# Altium schematic sheet Strain.SchDoc
size 297 x 209 mm; SheetNumber: 4; SheetTotal: 4; SheetTitle: Strain Gauge Frontend
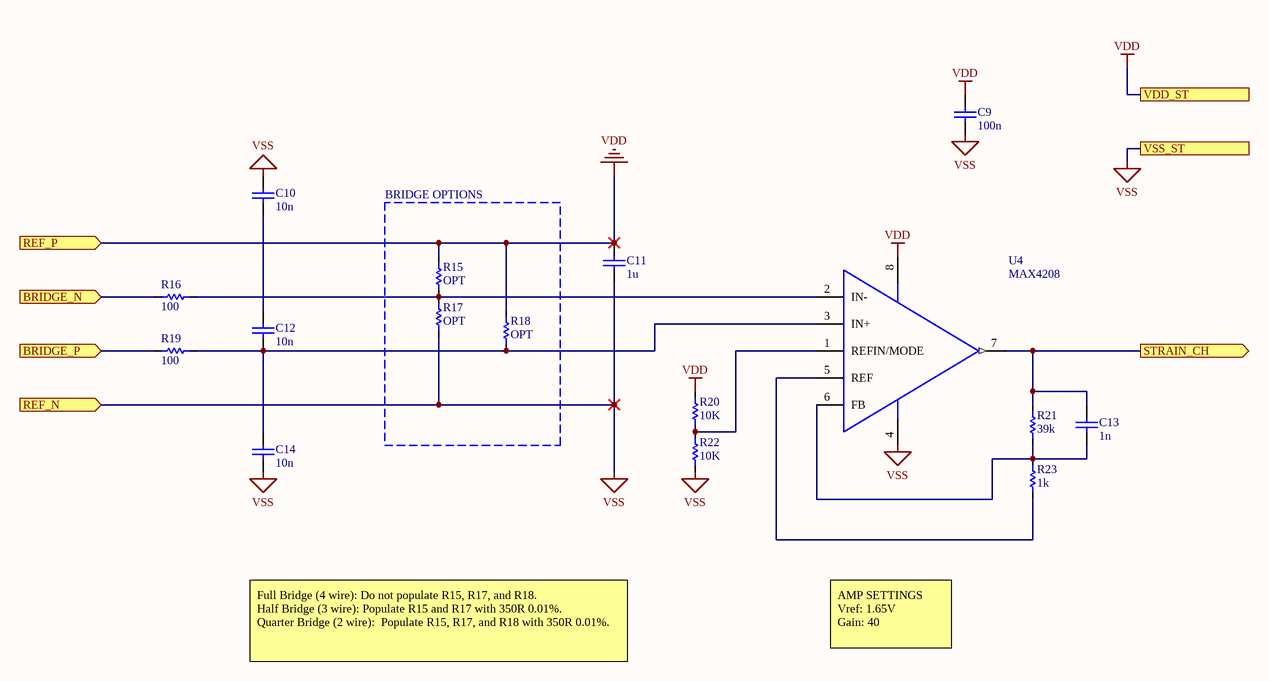
[diagram p0: Strain.SchDoc]

## Parts
C9  100n  [CAP_0603_M]
C10  10n  [CAP_0603_M]
C11  1u  [CAP_0603_M]
C12  10n  [CAP_0603_M]
C13  1n  [CAP_0603_M]
C14  10n  [CAP_0603_M]
R15  OPT  [RES_0603_M]
R16  100  [RES_0603_M]
R17  OPT  [RES_0603_M]
R18  OPT  [RES_0603_M]
R19  100  [RES_0603_M]
R20  10K  [RES_0603_M]
R21  39k  [RES_0603_M]
R22  10K  [RES_0603_M]
R23  1k  [RES_0603_M]
U4  MAX4208  [MAX4208_SOP127P600-8N]

## Blocks framed on the sheet
BRIDGE OPTIONS: R15 R17 R18

## Ports
BRIDGE_N (in), BRIDGE_P (in), REF_N (in), REF_P (in), STRAIN_CH (out), VDD_ST, VSS_ST

## Nets
VDD: C9.2 C11.2 R15.2 R18.2 R20.2 U4.8(V+) ; port REF_P, port VDD_ST
VSS: C9.1 C10.2 C11.1 C14.1 R17.1 R22.1 U4.4(V-) ; port REF_N, port VSS_ST
BRIDGE_N: R16.1 ; port BRIDGE_N
BRIDGE_P: R19.1 ; port BRIDGE_P
STRAIN_CH: C13.2 R21.2 U4.7(VO) ; port STRAIN_CH
NetC10_1: C10.1 C12.2
NetC12_1: C12.1 C14.2 R18.1 R19.2 U4.3(IN+)
NetC13_1: C13.1 R21.1 R23.2 U4.6(FB)
NetR15_1: R15.1 R16.2 R17.2 U4.2(IN-)
NetR20_1: R20.1 R22.2 U4.1(REFIN/MODE)
NetR23_1: R23.1 U4.5(REF)

## Notes on the sheet
- Full Bridge (4 wire): Do not populate R15, R17, and R18.
  Half Bridge (3 wire): Populate R15 and R17 with 350R 0.01%.
  Quarter Bridge (2 wire):  Populate R15, R17, and R18 with 350R 0.01%.
- AMP SETTINGS
  Vref: 1.65V
  Gain: 40
- Variant name
- Number:
- Date:
- Revision:
- Sheet
- of

## Library data of the parts
C9-C14 = CAP_0603: CAP Cnom Vcap Ptol Dial 0603; Category: capacitor; Created: 2018-07-01; Created By: JS; Last Modified: 2018-07-01
R15-R23 = RES_0603: RES OPT 1/5W 0603; Manufacturer: *; Manufacturer PN: *; Category: resistor; Created: 2018-07-01; Last Modified: 2018-07-01; Created By: JS
U4 = MAX4208: Manufacturer: Maxim; Manufacturer PN: MAX4208